# EAGLE design V0 (EAGLE 6.5.0)
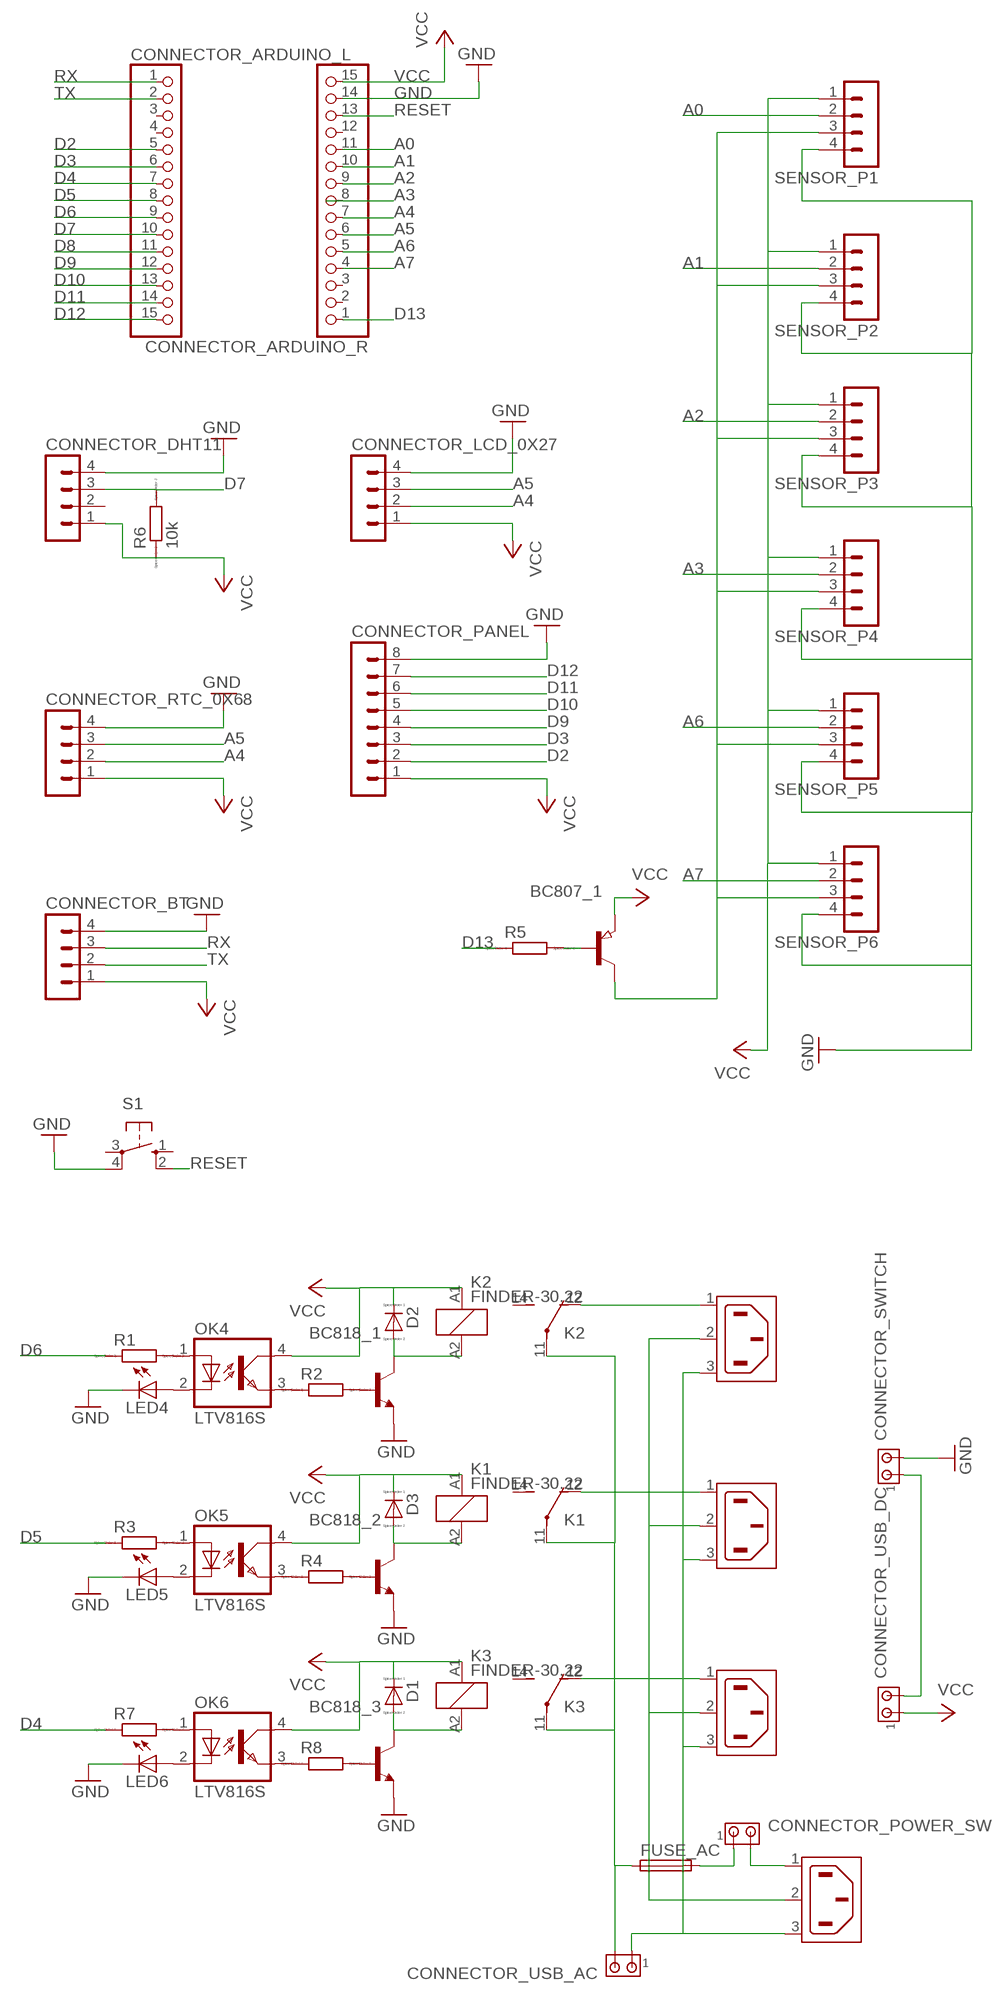
[diagram p0: schematic, sheet 1]

## Parts
BC807_1  PNP-TRANSISTOR_SOT23  [SOT23]
BC818_1  BC847ASMD  [SOT23]
BC818_2  BC847ASMD  [SOT23]
BC818_3  BC847ASMD  [SOT23]
CONNECTOR_ARDUINO_L  PINHD-1X15  [1X15]
CONNECTOR_ARDUINO_R  PINHD-1X15  [1X15]
CONNECTOR_BT  MA04-1  [MA04-1]
CONNECTOR_DHT11  MA04-1  [MA04-1]
CONNECTOR_LCD_0X27  MA04-1  [MA04-1]
CONNECTOR_PANEL  MA08-1  [MA08-1]
CONNECTOR_POWER_SWITCH  MTA02-100  [10X02MTA]
CONNECTOR_RTC_0X68  MA04-1  [MA04-1]
CONNECTOR_SWITCH  MTA02-100  [10X02MTA]
CONNECTOR_USB_AC  MTA02-100  [10X02MTA]
CONNECTOR_USB_DC  MTA02-100  [10X02MTA]
D1  DIODE_E-  [DIODE_SMB]
D2  DIODE_E-  [DIODE_SMB]
D3  DIODE_E-  [DIODE_SMB]
FUSE_AC  SH22,5  [SH22,5]
IN_AC  6ESRM-P  [6ESRM-P]
K1  FINDER-30.22  [FINDER-30.22]
K2  FINDER-30.22  [FINDER-30.22]
K3  FINDER-30.22  [FINDER-30.22]
LED4  LEDCHIPLED_0805  [CHIPLED_0805]
LED5  LEDCHIPLED_0805  [CHIPLED_0805]
LED6  LEDCHIPLED_0805  [CHIPLED_0805]
OK4  LTV816S  [SMD4]
OK5  LTV816S  [SMD4]
OK6  LTV816S  [SMD4]
OUT_LIGHT  6ESRM-P  [6ESRM-P]
OUT_PUMP  6ESRM-P  [6ESRM-P]
OUT_PUMP1  6ESRM-P  [6ESRM-P]
R1  R  [R0805]
R2  R  [R0805]
R3  R  [R0805]
R4  R  [R0805]
R5  R  [R0805]
R6  10k  R  [R0805]
R7  R  [R0805]
R8  R  [R0805]
S1  10-XX  [B3F-10XX]
SENSOR_P1  MA04-1  [MA04-1]
SENSOR_P2  MA04-1  [MA04-1]
SENSOR_P3  MA04-1  [MA04-1]
SENSOR_P4  MA04-1  [MA04-1]
SENSOR_P5  MA04-1  [MA04-1]
SENSOR_P6  MA04-1  [MA04-1]

## Nets
A0: CONNECTOR_ARDUINO_R.11 SENSOR_P1.2
A1: CONNECTOR_ARDUINO_R.10 SENSOR_P2.2
A2: CONNECTOR_ARDUINO_R.9 SENSOR_P3.2
A3: CONNECTOR_ARDUINO_R.8 SENSOR_P4.2
A4: CONNECTOR_ARDUINO_R.7 CONNECTOR_LCD_0X27.2 CONNECTOR_RTC_0X68.2
A5: CONNECTOR_ARDUINO_R.6 CONNECTOR_LCD_0X27.3 CONNECTOR_RTC_0X68.3
A6: CONNECTOR_ARDUINO_R.5 SENSOR_P5.2
A7: CONNECTOR_ARDUINO_R.4 SENSOR_P6.2
D2: CONNECTOR_ARDUINO_L.5 CONNECTOR_PANEL.2
D3: CONNECTOR_ARDUINO_L.6 CONNECTOR_PANEL.3
D4: CONNECTOR_ARDUINO_L.7 R7.1
D5: CONNECTOR_ARDUINO_L.8 R3.1
D6: CONNECTOR_ARDUINO_L.9 R1.1
D7: CONNECTOR_ARDUINO_L.10 CONNECTOR_DHT11.3 R6.2
D8: CONNECTOR_ARDUINO_L.11
D9: CONNECTOR_ARDUINO_L.12 CONNECTOR_PANEL.4
D10: CONNECTOR_ARDUINO_L.13 CONNECTOR_PANEL.5
D11: CONNECTOR_ARDUINO_L.14 CONNECTOR_PANEL.6
D12: CONNECTOR_ARDUINO_L.15 CONNECTOR_PANEL.7
D13: CONNECTOR_ARDUINO_R.1 R5.1
GND: BC818_1.2(E) BC818_2.2(E) BC818_3.2(E) CONNECTOR_ARDUINO_R.14 CONNECTOR_BT.4 CONNECTOR_DHT11.4 CONNECTOR_LCD_0X27.4 CONNECTOR_PANEL.8 CONNECTOR_RTC_0X68.4 CONNECTOR_SWITCH.2 LED4.C LED5.C LED6.C S1.4(P1) SENSOR_P1.4 SENSOR_P2.4 SENSOR_P3.4 SENSOR_P4.4 SENSOR_P5.4 SENSOR_P6.4
N$1: OK4.1(A) R1.2
N$2: OK5.1(A) R3.2
N$3: OK6.1(A) R7.2
N$4: BC818_1.3(C) D2.A(C) K2.A2
N$6: BC818_1.1(B) R2.2
N$7: CONNECTOR_USB_AC.2 FUSE_AC.1 K1.11(-1:P) K2.11(-1:P) K3.11(-1:P)
N$8: IN_AC.2(SH) OUT_LIGHT.2(SH) OUT_PUMP1.2(SH) OUT_PUMP.2(SH)
N$9: LED4.A OK4.2(C)
N$11: CONNECTOR_POWER_SWITCH.2 IN_AC.1(AC1)
N$12: LED5.A OK5.2(C)
N$13: LED6.A OK6.2(C)
N$14: BC818_2.3(C) D3.A(C) K1.A2
N$15: CONNECTOR_POWER_SWITCH.1 FUSE_AC.2
N$16: BC818_2.1(B) R4.2
N$17: K1.12(-1:O) OUT_PUMP.1(AC1)
N$18: K2.12(-1:O) OUT_LIGHT.1(AC1)
N$19: CONNECTOR_USB_AC.1 IN_AC.3(AC2) OUT_LIGHT.3(AC2) OUT_PUMP1.3(AC2) OUT_PUMP.3(AC2)
N$24: BC807_1.3(C) SENSOR_P1.3 SENSOR_P2.3 SENSOR_P3.3 SENSOR_P4.3 SENSOR_P5.3 SENSOR_P6.3
N$25: BC807_1.1(B) R5.2
N$28: OK4.3(EMIT) R2.1
N$31: OK5.3(EMIT) R4.1
N$38: OK6.3(EMIT) R8.1
N$42: BC818_3.3(C) D1.A(C) K3.A2
N$44: BC818_3.1(B) R8.2
N$46: K3.12(-1:O) OUT_PUMP1.1(AC1)
N$47: CONNECTOR_SWITCH.1 CONNECTOR_USB_DC.2
RESET: CONNECTOR_ARDUINO_R.13 S1.2(S1)
RX: CONNECTOR_ARDUINO_L.1 CONNECTOR_BT.3
TX: CONNECTOR_ARDUINO_L.2 CONNECTOR_BT.2
VCC: BC807_1.2(E) CONNECTOR_ARDUINO_R.15 CONNECTOR_BT.1 CONNECTOR_DHT11.1 CONNECTOR_LCD_0X27.1 CONNECTOR_PANEL.1 CONNECTOR_RTC_0X68.1 CONNECTOR_USB_DC.1 D1.C(A) D2.C(A) D3.C(A) K1.A1 K2.A1 K3.A1 OK4.4(COL) OK5.4(COL) OK6.4(COL) R6.1 SENSOR_P1.1 SENSOR_P2.1 SENSOR_P3.1 SENSOR_P4.1 SENSOR_P5.1 SENSOR_P6.1
Unconnected: CONNECTOR_ARDUINO_L.3 CONNECTOR_ARDUINO_L.4 CONNECTOR_ARDUINO_R.2 CONNECTOR_ARDUINO_R.3 CONNECTOR_ARDUINO_R.12 CONNECTOR_DHT11.2 K1.14(-1:S) K1.21(-2:P) K1.22(-2:O) K1.24(-2:S) K2.14(-1:S) K2.21(-2:P) K2.22(-2:O) K2.24(-2:S) K3.14(-1:S) K3.21(-2:P) K3.22(-2:O) K3.24(-2:S) S1.1(S) S1.3(P)

## Library data of the parts
BC807_1 = semicon-smd-ipc:PNP-TRANSISTOR_: PNP TRANSISTOR
BC818_1-BC818_3 = transistor-npn:BC847*: NPN Transistor
CONNECTOR_ARDUINO_L CONNECTOR_ARDUINO_R = pinhead:PINHD-1X15: PIN HEADER
CONNECTOR_BT CONNECTOR_DHT11 CONNECTOR_LCD_0X27 CONNECTOR_RTC_0X68 SENSOR_P1-SENSOR_P6 = con-lstb:MA04-1: PIN HEADER; OC_FARNELL: unknown; OC_NEWARK: unknown
CONNECTOR_PANEL = con-lstb:MA08-1: PIN HEADER; OC_FARNELL: unknown; OC_NEWARK: unknown
CONNECTOR_POWER_SWITCH CONNECTOR_SWITCH CONNECTOR_USB_AC CONNECTOR_USB_DC = con-amp:MTA02-100: AMP connector
D1-D3 = eagle-ltspice:DIODE_E-: Schottky Diode; SPICEMODEL: diode; SPICEPREFIX: D
FUSE_AC = fuse:SH22,5: FUSE HOLDER grid 22,5 mm, OGN0031 8201, Schurter (Buerklin); MF: SCHURTER; MPN: 0031.8201; OC_FARNELL: 1162740; OC_NEWARK: 96F8317
IN_AC OUT_LIGHT OUT_PUMP OUT_PUMP1 = con-tycoelectronics:6ESRM-P: AC Connector 120/250 VAC Source: http://catalog.tycoelectronics.com .. ENG_DS_1654001_1099_SR_0406.pdf; MF: TYCO ELECTRONICS; MPN: 6ESRM-P; OC_FARNELL: unknown; OC_NEWARK: 87F1821
K1-K3 = relay:FINDER-30.22: SUBMINIATURE DIL-RELAIS FINDER 30.22.9.024.0000 Kontakt max. AC - 125V Distributor: Farnell Bestell Nr.: 1217371 Source: http://www.farnell.com/datasheets/87634.pdf; OC_FARNELL: unknown; OC_NEWARK: unknown
LED4-LED6 = led:LED: LED OSRAM: - CHIPLED LG R971, LG N971, LY N971, LG Q971, LY Q971, LO R971, LY R971 LH N974, LH R974 LS Q976, LO Q976, LY Q976 LO Q996 - Hyper CHIPLED LW Q18S LB Q993, LB Q99A, LB R99A - SideLED LS A670, LO A670, LY A670, LG A670, LP A670 LB A673, LV A673, LT A673, LW A673 LH A674 LY A675 LS A676, LA A676, LO A676, LY A676, LW A676 LS A679, LY A679, LG A679 - Hyper Micro SIDELED® LS Y876, LA Y876, LO Y876, LY Y876 LT Y87S - SmartLED LW L88C, LW L88S LB L89C, LB L89S, LG L890 LS L89K, LO L89K, LY L89K LS L896, LA L896, LO L896, LY L896 - TOPLED LS T670, LO T670, LY T670, LG T670, LP T670 LSG T670, LSP T670, LSY T670, LOP T670, LYG T670 LG T671, LOG T671, LSG T671 LB T673, LV T673, LT T673, LW T673 LH T674 LS T676, LA T676, LO T676, LY T676, LB T676, LH T676, LSB T676, LW T676 LB T67C, LV T67C, LT T67C, LS T67K, LO T67K, LY T67K, LW E67C LS E67B, LA E67B, LO E67B, LY E67B, LB E67C, LV E67C, LT E67C LW T67C LS T679, LY T679, LG T679 LS T770, LO T770, LY T770, LG T770, LP T770 LB T773, LV T773, LT T773, LW T773 LH T774 LS E675, LA E675, LY E675, LS T675 LS T776, LA T776, LO T776, LY T776, LB T776 LHGB T686 LT T68C, LB T68C - Hyper Mini TOPLED® LB M676 - Mini TOPLED Santana® LG M470 LS M47K, LO M47K, LY M47K Source: http://www.osram.convergy.de LUXEON: - LUMILED® LXK2-PW12-R00, LXK2-PW12-S00, LXK2-PW14-U00, LXK2-PW14-V00 LXK2-PM12-R00, LXK2-PM12-S00, LXK2-PM14-U00 LXK2-PE12-Q00, LXK2-PE12-R00, LXK2-PE12-S00, LXK2-PE14-T00, LXK2-PE14-U00 LXK2-PB12-K00, LXK2-PB12-L00, LXK2-PB12-M00, LXK2-PB14-N00, LXK2-PB14-P00, LXK2-PB14-Q00 LXK2-PR12-L00, LXK2-PR12-M00, LXK2-PR14-Q00, LXK2-PR14-R00 LXK2-PD12-Q00, LXK2-PD12-R00, LXK2-PD12-S00 LXK2-PH12-R00, LXK2-PH12-S00 LXK2-PL12-P00, LXK2-PL12-Q00, LXK2-PL12-R00 Source: www.luxeon.com KINGBRIGHT: KA-3528ASYC Source: www.kingbright.com
OK4-OK6 = optocoupler:LTV816: OPTO COUPLER Source: LITEON, LTV816.pdf; OC_FARNELL: unknown; OC_NEWARK: unknown
R1-R8 = eagle-ltspice:R: RESISTOR, European symbol; SPICEMODEL: NONE; SPICEPREFIX: R
S1 = switch-omron:10-XX: OMRON SWITCH; MPN: B3F-1000; OC_FARNELL: 176432; OC_NEWARK: 36M3542

## Board
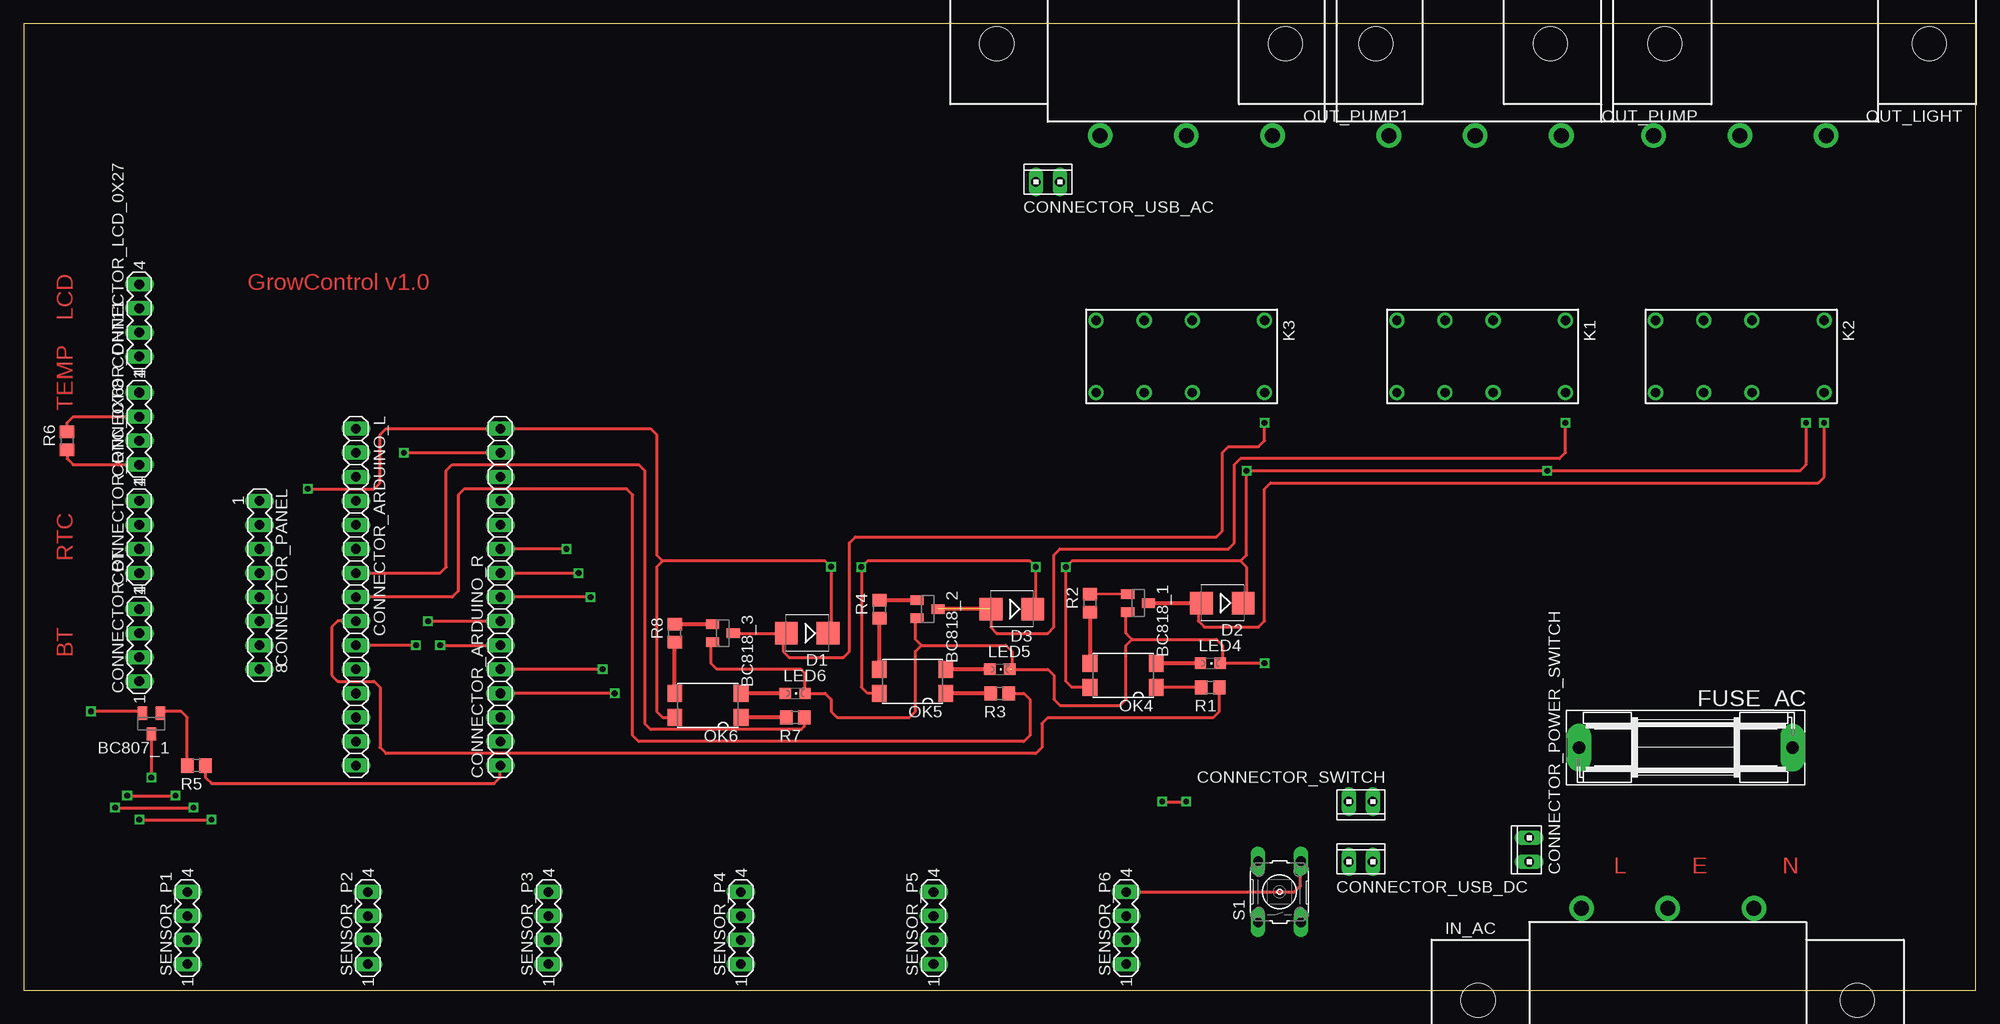
[diagram p1: board, top side]
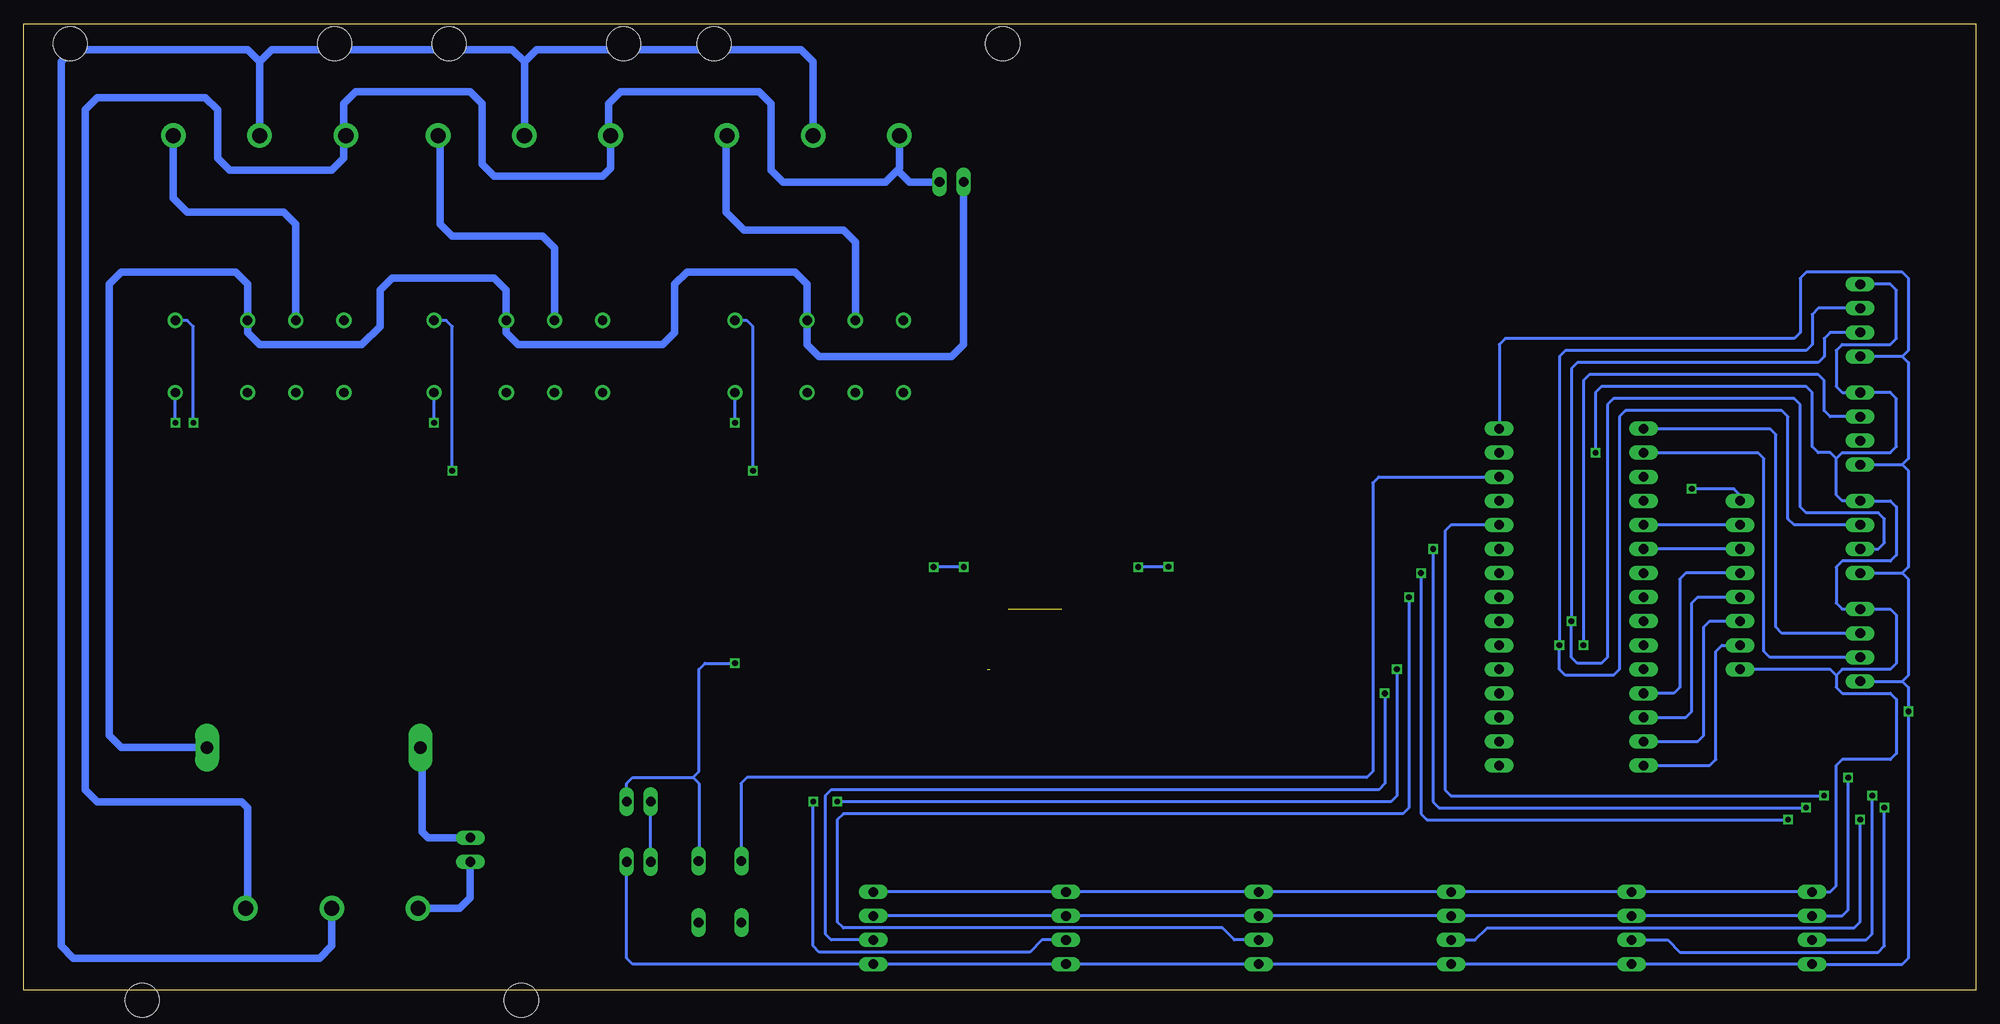
[diagram p2: board, bottom side, seen from below]

Size 206 x 102 mm. Coordinates in mm from the lower left corner, seen from the top.
Outline: 0,0 206,0 206,102 0,102 0,0
Copper layers (1*16): Top 0.035mm / dielectric 1.5mm / Bottom 0.035mm
Design rules "default": minimum track width 10mil, minimum drill 24mil, track to track 8mil, track to pad 8mil, pad to pad 8mil, via to via 8mil, smd to smd 8mil, copper to edge 40mil, drill to drill 8mil, minimum pad ring 10mil, minimum via ring 8mil, stop-mask expansion 4mil, vias tented up to drill 0mil, thermal gap 10mil

### Footprints (pad centres in the part's own frame; a part is rotated, then mirrored left to right if it is on the bottom)
SOT23 = smd 1 x 1.4: 1 -0.95,-1.1; 2 0.95,-1.1; 3 0,1.1
1X15 = drill 1.016 long: 1 -17.78,0; 2 -15.24,0; 3 -12.7,0; 4 -10.16,0; 5 -7.62,0; 6 -5.08,0; 7 -2.54,0; 8 0,0; 9 2.54,0; 10 5.08,0; 11 7.62,0; 12 10.16,0; 13 12.7,0; 14 15.24,0; 15 17.78,0
MA04-1 = drill 1.016 long: 1 -3.81,0; 2 -1.27,0; 3 1.27,0; 4 3.81,0
MA08-1 = drill 1.016 long: 1 -8.89,0; 2 -6.35,0; 3 -3.81,0; 4 -1.27,0; 5 1.27,0; 6 3.81,0; 7 6.35,0; 8 8.89,0
10X02MTA = drill 1.016 long: 1 1.27,0; 2 -1.27,0
DIODE_SMB = smd 2.4 x 2.4: A 2.2,0; C -2.2,0
SH22,5 = drill 1.321 pad 2.54 long: 1 -11.252,0; 2 11.252,0
6ESRM-P = drill 1.6 pad 2.6: 1 -9.1,9.7; 2 0,9.7; 3 9.1,9.7 | hole 3.6: -20,0; 20,0
FINDER-30.22 = drill 1 pad 1.6: 11 -1.27,-3.81; 12 3.81,-3.81; 14 8.89,-3.81; 21 -1.27,3.81; 22 3.81,3.81; 24 8.89,3.81; A1 -8.89,-3.81; A2 -8.89,3.81
CHIPLED_0805 = smd 1.2 x 1.2: A 0,-1.05; C 0,1.05
SMD4 = smd 1.78 x 1.55: 1 -1.27,-3.5; 2 1.27,-3.5; 3 1.27,3.5; 4 -1.27,3.5
R0805 = smd 1.3 x 1.5: 1 -0.95,0; 2 0.95,0
B3F-10XX = drill 1.016 long: 1 -3.251,2.261; 2 3.251,2.261; 3 -3.251,-2.261; 4 3.251,-2.261

### Placement (x,y rotation side)
BC807_1  13.47,28.14 180 top
BC818_1  117.61,40.84 270 top
BC818_2  95.38,40.2 270 top
BC818_3  73.79,37.66 270 top
CONNECTOR_ARDUINO_L  35.06,41.48 270 top
CONNECTOR_ARDUINO_R  50.3,41.48 90 top
CONNECTOR_BT  12.19,36.39 90 top
CONNECTOR_DHT11  12.19,59.26 90 top
CONNECTOR_LCD_0X27  12.19,70.69 90 top
CONNECTOR_PANEL  24.89,42.74 270 top
CONNECTOR_POWER_SWITCH  158.88,14.8 90 top
CONNECTOR_RTC_0X68  12.19,47.83 90 top
CONNECTOR_SWITCH  141.1,19.89 180 top
CONNECTOR_USB_AC  108.08,85.29 0 top
CONNECTOR_USB_DC  141.1,13.53 0 top
D1  82.68,37.66 180 top
D2  126.5,40.84 180 top
D3  104.27,40.2 180 top
FUSE_AC  175.39,25.6 180 top
IN_AC  173.49,-1.07 0 top
K1  153.8,66.88 180 top
K2  181.11,66.88 180 top
K3  122.05,66.88 180 top
LED4  125.22,34.49 270 top
LED5  103,33.86 270 top
LED6  81.41,31.32 270 top
OK4  116.02,33.22 90 top
OK5  93.79,32.59 90 top
OK6  72.2,30.05 90 top
OUT_LIGHT  181.11,99.9 180 top
OUT_PUMP  153.16,99.9 180 top
OUT_PUMP1  122.69,99.9 180 top
R1  125.22,31.95 180 top
R2  112.53,40.84 90 top
R3  103,31.32 180 top
R4  90.3,40.2 90 top
R5  18.23,23.7 180 top
R6  4.58,57.98 90 top
R7  81.41,28.77 180 top
R8  68.71,37.66 90 top
S1  132.53,10.36 90 top
SENSOR_P1  17.28,6.55 90 top
SENSOR_P2  36.33,6.55 90 top
SENSOR_P3  55.38,6.55 90 top
SENSOR_P4  75.69,6.55 90 top
SENSOR_P5  96.02,6.55 90 top
SENSOR_P6  116.34,6.55 90 top

### Tracks (layer width: path | path; a pad name or v marks a point on that pad's centre or on a via)
A0  (via drill 0.6)
  Top 0.305: v10.92,20.52 v16,20.52
  Bottom 0.305: SENSOR_P1.2 11.56,5.28 10.92,5.91 v10.92,20.52 | v16,20.52 55.38,20.52 56.01,21.16 56.01,48.46 55.38,49.09 CONNECTOR_ARDUINO_R.11
A1  (via drill 0.6)
  Top 0.305: v9.66,19.25 v17.91,19.25 | v57.28,46.55 CONNECTOR_ARDUINO_R.10
  Bottom 0.305: SENSOR_P2.2 32.52,5.28 31.25,4.01 10.29,4.01 9.66,4.65 v9.66,19.25 | v57.28,46.55 57.28,19.89 56.65,19.25 v17.91,19.25
A2  (via drill 0.6)
  Top 0.305: v12.19,17.98 v19.81,17.98 | CONNECTOR_ARDUINO_R.9 v58.55,44.02
  Bottom 0.305: SENSOR_P3.2 52.84,5.28 51.56,6.55 12.83,6.55 12.19,7.19 v12.19,17.98 | v58.55,44.02 58.55,18.62 57.91,17.98 v19.81,17.98
A3  (via drill 0.6)
  Top 0.305: v59.82,41.48 CONNECTOR_ARDUINO_R.8
  Bottom 0.305: SENSOR_P4.2 78.23,5.28 79.5,6.55 119.51,6.55 120.14,7.19 120.14,17.98 119.51,18.62 60.45,18.62 59.82,19.25 v59.82,41.48
A4  (via drill 0.6)
  Top 0.305: v42.67,38.94 CONNECTOR_ARDUINO_R.7
  Bottom 0.305: CONNECTOR_LCD_0X27.2 15.37,69.41 16,68.78 16,66.88 16.64,66.24 42.04,66.24 42.67,65.61 v42.67,38.94 42.67,35.12 42.04,34.49 39.5,34.49 38.86,35.12 38.86,61.8 38.23,62.43 19.18,62.43 18.55,61.8 18.55,51 17.91,50.37 10.29,50.37 9.66,49.73 9.66,47.19 10.29,46.55 CONNECTOR_RTC_0X68.2
A5  (via drill 0.6)
  Top 0.305: v43.95,36.39 CONNECTOR_ARDUINO_R.6
  Bottom 0.305: CONNECTOR_LCD_0X27.3 16.64,71.95 17.28,71.32 17.28,68.14 17.91,67.51 43.31,67.51 43.95,66.88 v43.95,36.39 43.95,33.86 43.31,33.22 38.23,33.22 37.59,33.86 37.59,60.52 36.96,61.16 20.45,61.16 19.81,60.52 19.81,49.73 19.18,49.09 CONNECTOR_RTC_0X68.3
A6  (via drill 0.6)
  Top 0.305: v120.14,19.89 v122.69,19.89 | v61.09,33.86 CONNECTOR_ARDUINO_R.5
  Bottom 0.305: SENSOR_P5.2 98.56,5.28 99.83,4.01 122.05,4.01 122.69,4.65 v122.69,19.89 | v61.09,33.86 61.09,20.52 61.73,19.89 v120.14,19.89
A7  (via drill 0.6)
  Top 0.305: v62.36,31.32 CONNECTOR_ARDUINO_R.4
  Bottom 0.305: SENSOR_P6.2 120.78,5.28 121.41,5.91 121.41,20.52 120.78,21.16 62.99,21.16 62.36,21.79 v62.36,31.32
D2
  Bottom 0.305: CONNECTOR_PANEL.2 CONNECTOR_ARDUINO_L.5
D3
  Bottom 0.305: CONNECTOR_PANEL.3 CONNECTOR_ARDUINO_L.6
D4
  Top 0.305: 82.36,27.82 R7.1 82.36,27.82 82.05,27.5 66.17,27.5 65.53,28.14 65.53,54.81 64.9,55.45 45.22,55.45 44.58,54.81 44.58,44.65 43.95,44.02 CONNECTOR_ARDUINO_L.7
D5
  Top 0.305: R3.1 105.54,31.32 106.17,30.68 106.17,26.87 105.54,26.23 64.9,26.23 64.27,26.87 64.27,52.27 63.63,52.91 46.48,52.91 45.85,52.27 45.85,42.11 45.22,41.48 CONNECTOR_ARDUINO_L.8
D6
  Top 0.305: R1.1 126.18,29.41 125.54,28.77 108.08,28.77 107.44,28.14 107.44,25.6 106.81,24.96 38.23,24.96 37.59,25.6 37.59,31.95 36.96,32.59 33.15,32.59 32.52,33.22 32.52,38.3 33.15,38.94 CONNECTOR_ARDUINO_L.9
D7  (via drill 0.6)
  Top 0.305: R6.2 4.58,59.89 5.21,60.52 CONNECTOR_DHT11.3 | v41.41,36.39 CONNECTOR_ARDUINO_L.10
  Bottom 0.305: CONNECTOR_DHT11.3 15.37,60.52 16,61.16 16,64.34 16.64,64.97 40.77,64.97 41.41,64.34 v41.41,36.39
D9
  Bottom 0.305: CONNECTOR_PANEL.4 30.61,44.02 31.25,43.38 31.25,31.95 31.88,31.32 CONNECTOR_ARDUINO_L.12
D10
  Bottom 0.305: CONNECTOR_ARDUINO_L.13 30.61,28.77 29.97,29.41 29.97,40.84 29.34,41.48 CONNECTOR_PANEL.5
D11
  Bottom 0.305: CONNECTOR_ARDUINO_L.14 29.34,26.23 28.7,26.87 28.7,38.3 28.07,38.94 CONNECTOR_PANEL.6
D12
  Bottom 0.305: CONNECTOR_ARDUINO_L.15 28.07,23.7 27.44,24.33 27.44,35.76 26.8,36.39 CONNECTOR_PANEL.7
D13
  Top 0.305: R5.1 19.18,22.43 19.81,21.79 49.66,21.79 50.3,22.43 CONNECTOR_ARDUINO_R.1
GND  (via drill 0.6)  (1 unrouted)
  Top 0.305: 104.27,33.86 108.08,33.86 108.72,33.22 108.72,30.68 109.35,30.05 115.7,30.05 116.34,30.68 116.34,36.39 116.97,37.03 | SENSOR_P6.4 134.12,10.36 134.75,10.99 134.75,13.57 S1.4 | v40.13,56.72 CONNECTOR_ARDUINO_R.14 | v130.94,34.49 LED4.C 126.5,34.71 126.5,36.39 125.86,37.03 116.97,37.03 | 94.75,36.39 94.11,35.76 94.11,29.41 93.47,28.77 85.86,28.77 85.22,29.41 85.22,30.68 84.59,31.32 LED6.C 82.46,33.44 82.05,33.86 73.16,33.86 72.52,34.49 72.52,36.55 | 94.75,36.39 94.11,37.03 94.11,39.09 | 94.75,36.39 103.64,36.39 104.27,35.76 104.27,34.08 LED5.C | 116.97,37.03 116.34,37.66 116.34,39.72
  Top 0.406: 116.34,39.72 BC818_1.2 | 94.11,39.09 BC818_2.2 | 72.52,36.55 BC818_3.2
  Bottom 0.305: SENSOR_P6.4 SENSOR_P5.4 SENSOR_P4.4 SENSOR_P3.4 SENSOR_P2.4 SENSOR_P1.4 15.37,10.36 14.73,10.99 14.73,23.7 14.1,24.33 9.02,24.33 8.39,24.96 8.39,30.68 9.02,31.32 14.1,31.32 14.73,31.95 14.73,33.22 | 14.73,56.08 14.73,52.27 14.1,51.63 CONNECTOR_RTC_0X68.4 9.02,51.63 8.39,51 8.39,45.92 9.02,45.28 14.1,45.28 14.73,44.65 14.73,40.84 14.1,40.2 CONNECTOR_BT.4 9.02,40.2 8.39,39.57 8.39,34.49 9.02,33.86 14.1,33.86 14.73,33.22 | 14.73,56.08 14.1,56.72 9.02,56.72 8.39,57.35 8.39,62.43 9.02,63.06 CONNECTOR_DHT11.4 14.1,63.06 14.73,63.7 14.73,67.51 14.1,68.14 9.02,68.14 8.39,68.78 8.39,73.86 9.02,74.5 CONNECTOR_LCD_0X27.4 | 14.73,56.08 15.37,56.72 16.64,56.72 17.28,57.35 17.28,63.06 17.91,63.7 39.5,63.7 40.13,63.06 v40.13,56.72 | 134.86,13.53 S1.4 134.75,13.65 134.75,21.79 135.38,22.43 | CONNECTOR_SWITCH.2 142.37,21.79 141.74,22.43 135.38,22.43 | 14.73,33.22 15.37,33.86 CONNECTOR_PANEL.8 | 135.38,22.43 134.75,23.06 134.75,33.86 134.12,34.49 v130.94,34.49
N$1
  Top 0.305: R1.2 OK4.1
N$2
  Top 0.406: R3.2 OK5.1
N$3
  Top 0.406: R7.2 OK6.1
N$4  (via drill 0.6)
  Top 0.305: 123.95,40.84 123.95,38.94 124.59,38.3 130.31,38.3 130.94,38.94 130.94,52.91 131.57,53.54 189.36,53.54 190,54.17 v190,59.89
  Top 0.406: BC818_1.3 123.95,40.84 D2.A
  Bottom 0.305: v190,59.89 K2.A2
N$5  (via drill 0.6)
  other vias: 106.81,44.65
N$6
  Top 0.254: R2.2 BC818_1.1
N$7
  Bottom 0.813: FUSE_AC.1 195.71,25.6 196.98,26.87 196.98,74.5 195.71,75.77 183.64,75.77 182.38,74.5 K2.11 182.38,69.41 181.11,68.14 170.31,68.14 168.41,70.05 168.41,73.86 167.13,75.13 156.34,75.13 155.07,73.86 K1.11 155.07,69.41 153.8,68.14 138.56,68.14 137.29,69.41 137.29,74.5 136.02,75.77 124.59,75.77 123.32,74.5 K3.11 123.32,68.14 122.05,66.88 108.08,66.88 106.81,68.14 CONNECTOR_USB_AC.2
N$8
  Bottom 0.813: OUT_PUMP1.2 122.69,97.99 123.95,99.26 151.9,99.26 153.16,97.99 | 153.16,97.99 OUT_PUMP.2 | 181.11,97.99 179.83,99.26 154.44,99.26 153.16,97.99 | OUT_LIGHT.2 181.11,97.99 | 181.11,97.99 182.38,99.26 200.79,99.26 202.06,97.99 202.06,4.65 200.79,3.38 174.75,3.38 173.49,4.65 IN_AC.2
N$9
  Top 0.406: LED4.A OK4.2
N$11
  Bottom 0.813: IN_AC.1 159.97,8.63 158.88,9.73 CONNECTOR_POWER_SWITCH.2
N$12
  Top 0.406: LED5.A OK5.2
N$13
  Top 0.406: LED6.A OK6.2
N$14  (via drill 0.6)  (1 unrouted)
  Top 0.305: D3.A 102.07,38.28 102.68,37.66 108.08,37.66 108.72,38.3 108.72,45.92 109.35,46.55 127.13,46.55 127.77,47.19 127.77,55.45 128.4,56.08 162.06,56.08 162.69,56.72 v162.69,59.89
  Bottom 0.305: v162.69,59.89 K1.A2
N$15
  Bottom 0.813: CONNECTOR_POWER_SWITCH.1 163.32,16.08 163.96,16.71 163.96,25.42 FUSE_AC.2
N$16
  Top 0.406: R4.2 BC818_2.1
N$17
  Bottom 0.813: K1.12 149.99,78.31 151.26,79.58 160.78,79.58 162.06,80.84 162.06,89.98 OUT_PUMP.1
N$18
  Bottom 0.813: OUT_LIGHT.1 190.2,83.59 188.72,82.11 178.56,82.11 177.3,80.84 K2.12
N$19
  Bottom 0.813: OUT_PUMP1.3 113.59,86.77 113.8,86.56 | 172.22,90.41 172.22,93.55 170.94,94.81 158.88,94.81 157.61,93.55 157.61,87.19 156.34,85.92 144.91,85.92 144.06,86.77 OUT_PUMP.3 144.28,90.41 144.28,93.55 143,94.81 128.4,94.81 127.13,93.55 127.13,86.56 125.86,85.29 115.06,85.29 113.8,86.56 | 172.22,90.41 OUT_LIGHT.3 | 172.22,90.41 172.22,87.83 173.49,86.56 184.28,86.56 185.55,87.83 185.55,92.91 186.82,94.18 198.25,94.18 199.52,92.91 199.52,21.16 198.25,19.89 183.01,19.89 182.38,19.25 182.38,8.84 IN_AC.3 | 113.8,86.56 112.53,85.29 CONNECTOR_USB_AC.1
N$24  (via drill 0.6)
  Top 0.305: BC807_1.3 v13.47,22.43
  Bottom 0.305: SENSOR_P6.3 SENSOR_P5.3 SENSOR_P4.3 SENSOR_P3.3 SENSOR_P2.3 SENSOR_P1.3 14.1,7.82 13.47,8.45 v13.47,22.43
N$25
  Top 0.305: R5.2 17.28,28.77 16.64,29.41 14.58,29.41 BC807_1.1
N$28
  Top 0.406: R2.1 OK4.3
N$31
  Top 0.406: OK5.3 90.29,39.25 R4.1
N$38
  Top 0.406: OK6.3 R8.1
N$41
  Top 0.406: 102.36,40.2 96.65,40.2
N$42  (via drill 0.6)
  Top 0.305: D1.A 80.14,37.66 | BC818_3.3 80.14,37.66 | 80.14,37.66 80.14,35.76 80.78,35.12 86.49,35.12 87.12,35.76 87.12,47.19 87.76,47.83 125.86,47.83 126.5,48.46 126.5,56.72 127.13,57.35 130.31,57.35 130.94,57.98 v130.94,59.89
  Bottom 0.305: v130.94,59.89 K3.A2
N$44
  Top 0.406: BC818_3.1 R8.2
N$46
  Bottom 0.813: K3.12 118.24,78.94 119.51,80.21 129.99,80.21 131.89,82.11 131.89,90.09 OUT_PUMP1.1
N$47
  Bottom 0.305: CONNECTOR_USB_DC.2 CONNECTOR_SWITCH.1
RESET
  Bottom 0.305: S1.2 130.31,13.65 130.31,21.79 129.67,22.43 64.27,22.43 63.63,23.06 63.63,53.54 62.99,54.17 CONNECTOR_ARDUINO_R.13
RX
  Bottom 0.305: CONNECTOR_BT.3 20.45,37.66 21.08,38.3 21.08,58.62 21.72,59.26 CONNECTOR_ARDUINO_L.1
TX
  Bottom 0.305: CONNECTOR_BT.2 21.72,35.12 22.36,35.76 22.36,56.08 22.99,56.72 CONNECTOR_ARDUINO_L.2
VCC  (via drill 0.6)
  Top 0.305: R6.1 4.58,56.08 5.21,55.45 CONNECTOR_DHT11.1 | OK6.4 67.44,28.77 66.81,29.41 66.81,44.65 67.44,45.28 | 67.44,45.28 84.59,45.28 v85.2,44.67 85.2,37.98 D1.C | OK5.4 89.03,31.32 88.39,31.95 v88.39,44.65 89.03,45.28 106.17,45.28 v106.79,44.67 106.79,40.52 D3.C | 128.4,45.28 129.03,44.65 129.03,41.18 D2.C | 128.4,45.28 110.62,45.28 v109.98,44.65 109.98,32.59 110.62,31.95 OK4.4 | v188.09,59.89 188.09,55.45 187.45,54.81 v160.78,54.81 v129.03,54.81 129.03,45.92 128.4,45.28 | v29.97,52.91 36.96,52.91 37.59,53.54 37.59,58.62 38.23,59.26 CONNECTOR_ARDUINO_R.15 66.17,59.26 66.81,58.62 66.81,45.92 67.44,45.28 | BC807_1.2 12.36,29.24 12.19,29.41 v7.11,29.41
  Bottom 0.305: CONNECTOR_BT.1 7.75,32.59 | 7.75,32.59 7.11,33.22 7.11,43.38 7.75,44.02 | 7.75,32.59 7.11,31.95 v7.11,29.41 7.11,3.38 7.75,2.74 SENSOR_P1.1 SENSOR_P2.1 SENSOR_P3.1 SENSOR_P4.1 SENSOR_P5.1 SENSOR_P6.1 141.74,2.74 142.37,3.38 CONNECTOR_USB_DC.1 | 7.75,66.88 7.11,66.24 7.11,56.08 7.75,55.45 | 7.75,66.88 CONNECTOR_LCD_0X27.1 | CONNECTOR_RTC_0X68.1 7.75,44.02 | 7.75,44.02 7.11,44.65 7.11,54.81 7.75,55.45 | CONNECTOR_DHT11.1 7.75,55.45 | 7.75,66.88 7.11,67.51 7.11,75.13 7.75,75.77 17.91,75.77 18.55,75.13 18.55,69.41 19.18,68.78 49.66,68.78 50.3,68.14 CONNECTOR_ARDUINO_R.15 | v129.03,54.81 129.03,70.05 129.67,70.69 K3.A1 | v160.78,54.81 160.78,70.05 161.42,70.69 K1.A1 | v188.09,59.89 188.09,70.05 188.72,70.69 K2.A1 | CONNECTOR_PANEL.1 24.89,52.27 25.53,52.91 v29.97,52.91 | v85.2,44.67 88.37,44.67 v88.39,44.65 | v106.79,44.67 109.96,44.67 v109.98,44.65

### Text on the board
Top: GrowControl v1.0 | LCD | TEMP | RTC | BT | L | E | N